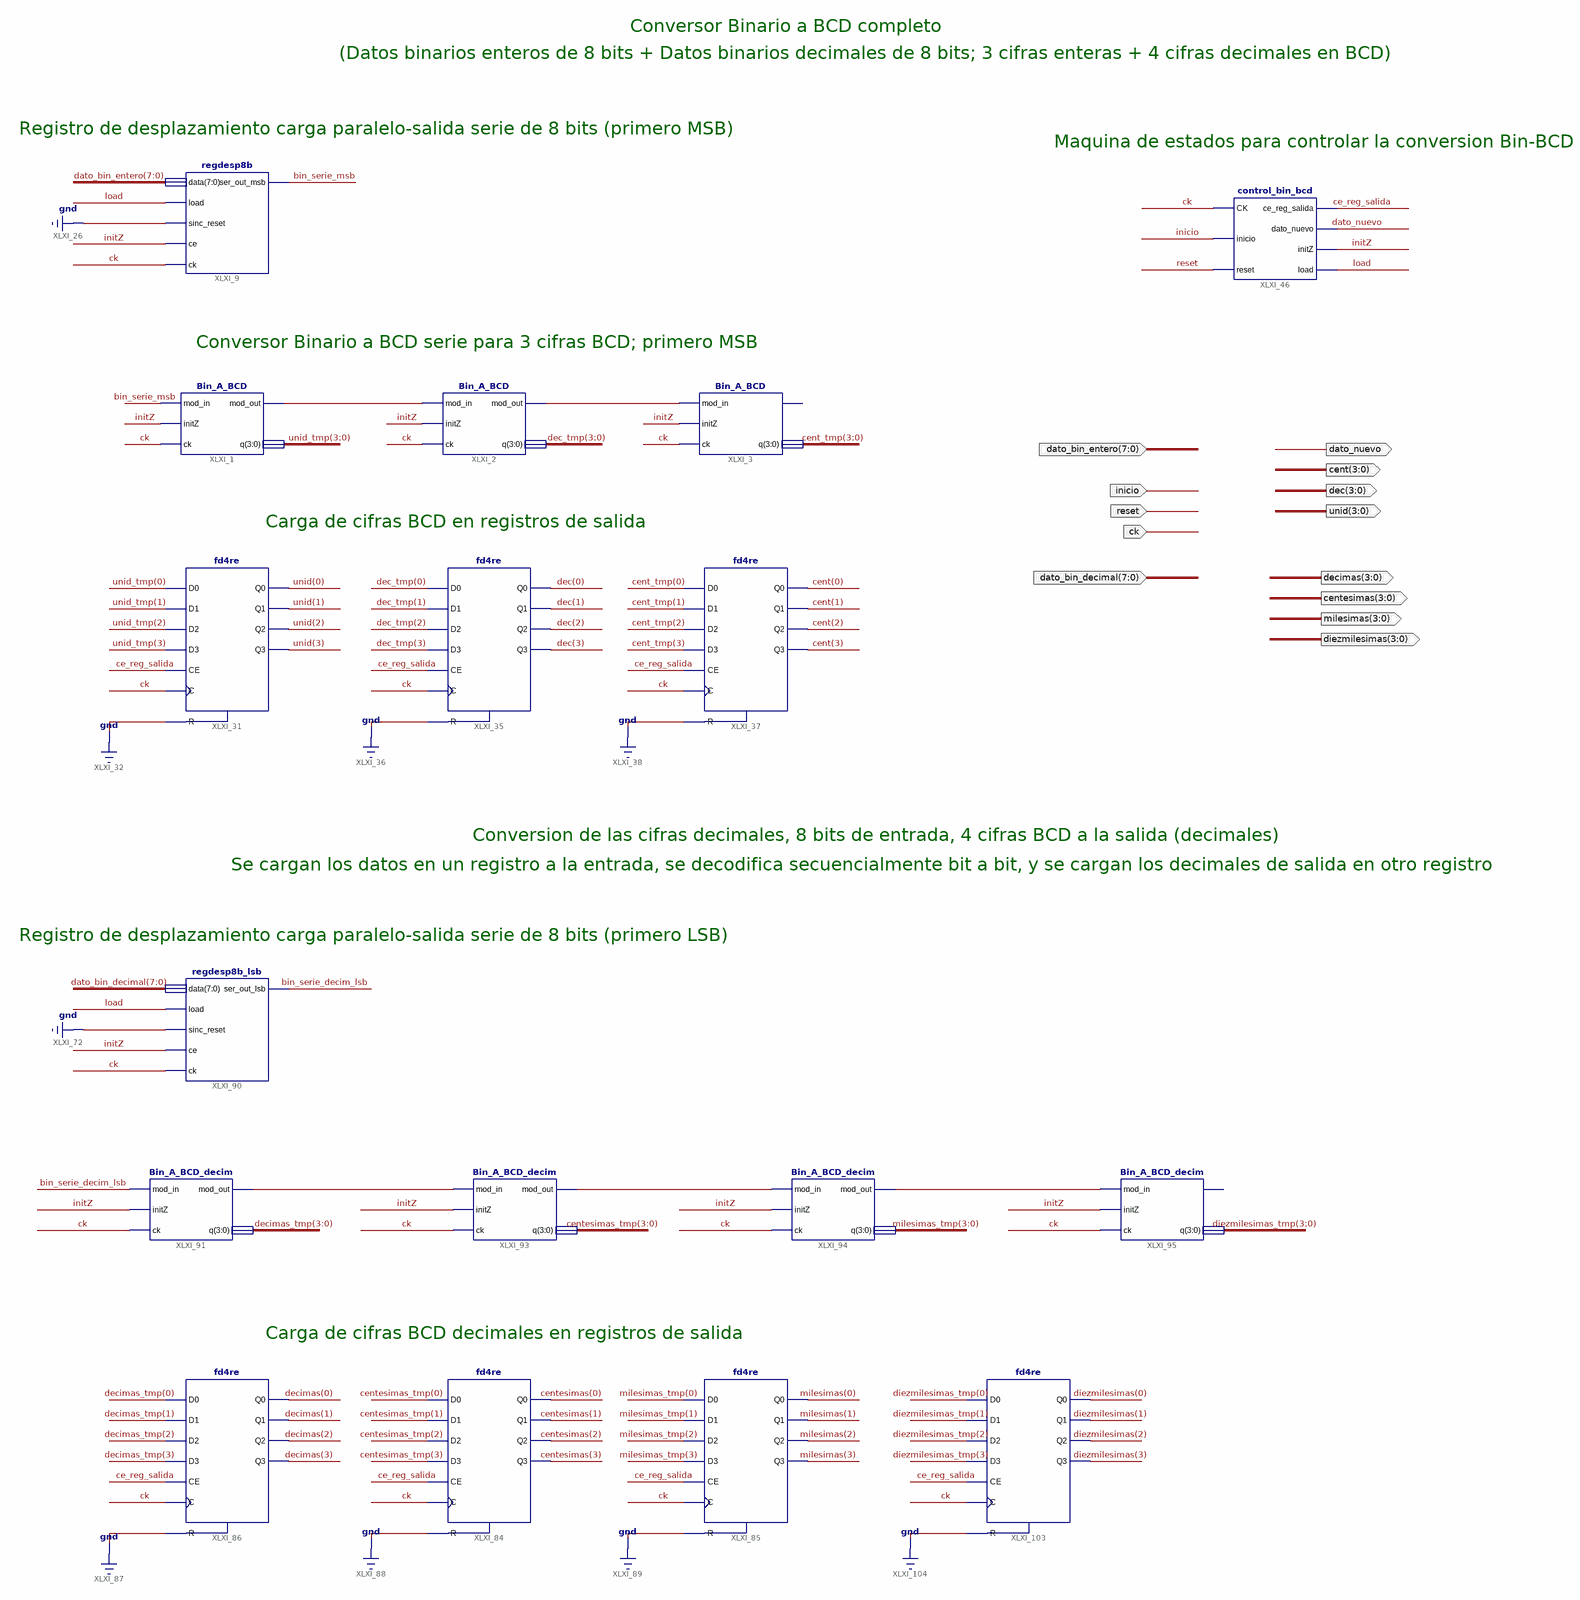
[diagram p0: schematic sheet 1]
// Xilinx ISE schematic Conversor_Bin_BCD_decim.sch (spartan6) as structural Verilog: 17 symbols, 13 ports
module Conversor_Bin_BCD_decim (
  input  ck,
  input  [7:0] dato_bin_entero,
  input  inicio,
  input  reset,
  input  [7:0] dato_bin_decimal,
  output dato_nuevo,
  output [3:0] unid,
  output [3:0] dec,
  output [3:0] cent,
  output [3:0] decimas,
  output [3:0] centesimas,
  output [3:0] milesimas,
  output [3:0] diezmilesimas
);

  wire bin_serie_decim_lsb, bin_serie_msb, ce_reg_salida, initZ, load, XLXN_8, XLXN_9, XLXN_468, XLXN_469,
       XLXN_470;
  wire [3:0] cent_tmp, centesimas_tmp, dec_tmp, decimas_tmp, diezmilesimas_tmp, milesimas_tmp, unid_tmp;

  regdesp8b XLXI_9 (
    .ck(ck), .ce(initZ), .sinc_reset(1'b0), .load(load), .data(dato_bin_entero), .ser_out_msb(bin_serie_msb));
  Bin_A_BCD XLXI_2 (.mod_out(XLXN_8), .q(dec_tmp), .mod_in(XLXN_9), .initZ(initZ), .ck(ck));
  Bin_A_BCD XLXI_1 (.mod_out(XLXN_9), .q(unid_tmp), .mod_in(bin_serie_msb), .initZ(initZ), .ck(ck));
  Bin_A_BCD XLXI_3 (.q(cent_tmp), .mod_in(XLXN_8), .initZ(initZ), .ck(ck));  // open: mod_out
  fd4re XLXI_35 (
    .C(ck), .CE(ce_reg_salida), .D0(dec_tmp[0]), .D1(dec_tmp[1]), .D2(dec_tmp[2]), .D3(dec_tmp[3]), .R(1'b0),
    .Q0(dec[0]), .Q1(dec[1]), .Q2(dec[2]), .Q3(dec[3]));
  fd4re XLXI_37 (
    .C(ck), .CE(ce_reg_salida), .D0(cent_tmp[0]), .D1(cent_tmp[1]), .D2(cent_tmp[2]), .D3(cent_tmp[3]),
    .R(1'b0), .Q0(cent[0]), .Q1(cent[1]), .Q2(cent[2]), .Q3(cent[3]));
  fd4re XLXI_31 (
    .C(ck), .CE(ce_reg_salida), .D0(unid_tmp[0]), .D1(unid_tmp[1]), .D2(unid_tmp[2]), .D3(unid_tmp[3]),
    .R(1'b0), .Q0(unid[0]), .Q1(unid[1]), .Q2(unid[2]), .Q3(unid[3]));
  control_bin_bcd XLXI_46 (
    .CK(ck), .inicio(inicio), .reset(reset), .ce_reg_salida(ce_reg_salida), .dato_nuevo(dato_nuevo),
    .initZ(initZ), .load(load));
  fd4re XLXI_84 (
    .C(ck), .CE(ce_reg_salida), .D0(centesimas_tmp[0]), .D1(centesimas_tmp[1]), .D2(centesimas_tmp[2]),
    .D3(centesimas_tmp[3]), .R(1'b0), .Q0(centesimas[0]), .Q1(centesimas[1]), .Q2(centesimas[2]),
    .Q3(centesimas[3]));
  fd4re XLXI_85 (
    .C(ck), .CE(ce_reg_salida), .D0(milesimas_tmp[0]), .D1(milesimas_tmp[1]), .D2(milesimas_tmp[2]),
    .D3(milesimas_tmp[3]), .R(1'b0), .Q0(milesimas[0]), .Q1(milesimas[1]), .Q2(milesimas[2]),
    .Q3(milesimas[3]));
  fd4re XLXI_86 (
    .C(ck), .CE(ce_reg_salida), .D0(decimas_tmp[0]), .D1(decimas_tmp[1]), .D2(decimas_tmp[2]),
    .D3(decimas_tmp[3]), .R(1'b0), .Q0(decimas[0]), .Q1(decimas[1]), .Q2(decimas[2]), .Q3(decimas[3]));
  regdesp8b_lsb XLXI_90 (
    .sinc_reset(1'b0), .ser_out_lsb(bin_serie_decim_lsb), .ck(ck), .data(dato_bin_decimal), .load(load),
    .ce(initZ));
  Bin_A_BCD_decim XLXI_91 (.mod_out(XLXN_468), .q(decimas_tmp), .initZ(initZ), .ck(ck), .mod_in(bin_serie_decim_lsb));
  Bin_A_BCD_decim XLXI_93 (.mod_out(XLXN_469), .q(centesimas_tmp), .initZ(initZ), .ck(ck), .mod_in(XLXN_468));
  Bin_A_BCD_decim XLXI_94 (.mod_out(XLXN_470), .q(milesimas_tmp), .initZ(initZ), .ck(ck), .mod_in(XLXN_469));
  Bin_A_BCD_decim XLXI_95 (.q(diezmilesimas_tmp), .initZ(initZ), .ck(ck), .mod_in(XLXN_470));  // open: mod_out
  fd4re XLXI_103 (
    .C(ck), .CE(ce_reg_salida), .D0(diezmilesimas_tmp[0]), .D1(diezmilesimas_tmp[1]),
    .D2(diezmilesimas_tmp[2]), .D3(diezmilesimas_tmp[3]), .R(1'b0), .Q0(diezmilesimas[0]),
    .Q1(diezmilesimas[1]), .Q2(diezmilesimas[2]), .Q3(diezmilesimas[3]));

  // Notes on the sheet:
  //   Conversor Binario a BCD completo
  //   (Datos binarios enteros de 8 bits + Datos binarios decimales de 8 bits; 3 cifras enteras + 4 cifras decimales en BCD)
  //   Registro de desplazamiento carga paralelo-salida serie de 8 bits (primero MSB)
  //   Maquina de estados para controlar la conversion Bin-BCD
  //   Conversor Binario a BCD serie para 3 cifras BCD; primero MSB
  //   Carga de cifras BCD en registros de salida
  //   Conversion de las cifras decimales, 8 bits de entrada, 4 cifras BCD a la salida (decimales)
  //   Se cargan los datos en un registro a la entrada, se decodifica secuencialmente bit a bit, y se cargan los decimales de salida en otro registro
  //   Registro de desplazamiento carga paralelo-salida serie de 8 bits (primero LSB)
  //   Carga de cifras BCD decimales en registros de salida
endmodule
